# Altium schematic sheet Heating.SchDoc
size 381 x 279 mm; Organization: SACO Technologies; Address1: 7806, Trans-Canada Hwy; Address2: Montreal, QC, Canada - H4S1L3.; Address3: H4S1L3; SheetNumber: 5; SheetTotal: 6; ELE682ProjectName: Conditionning & TLL PCB; ProjectRevision: C; SchDesignedBy1: Alexis Gagnon; SchDesignedBy2: Megane Cyr
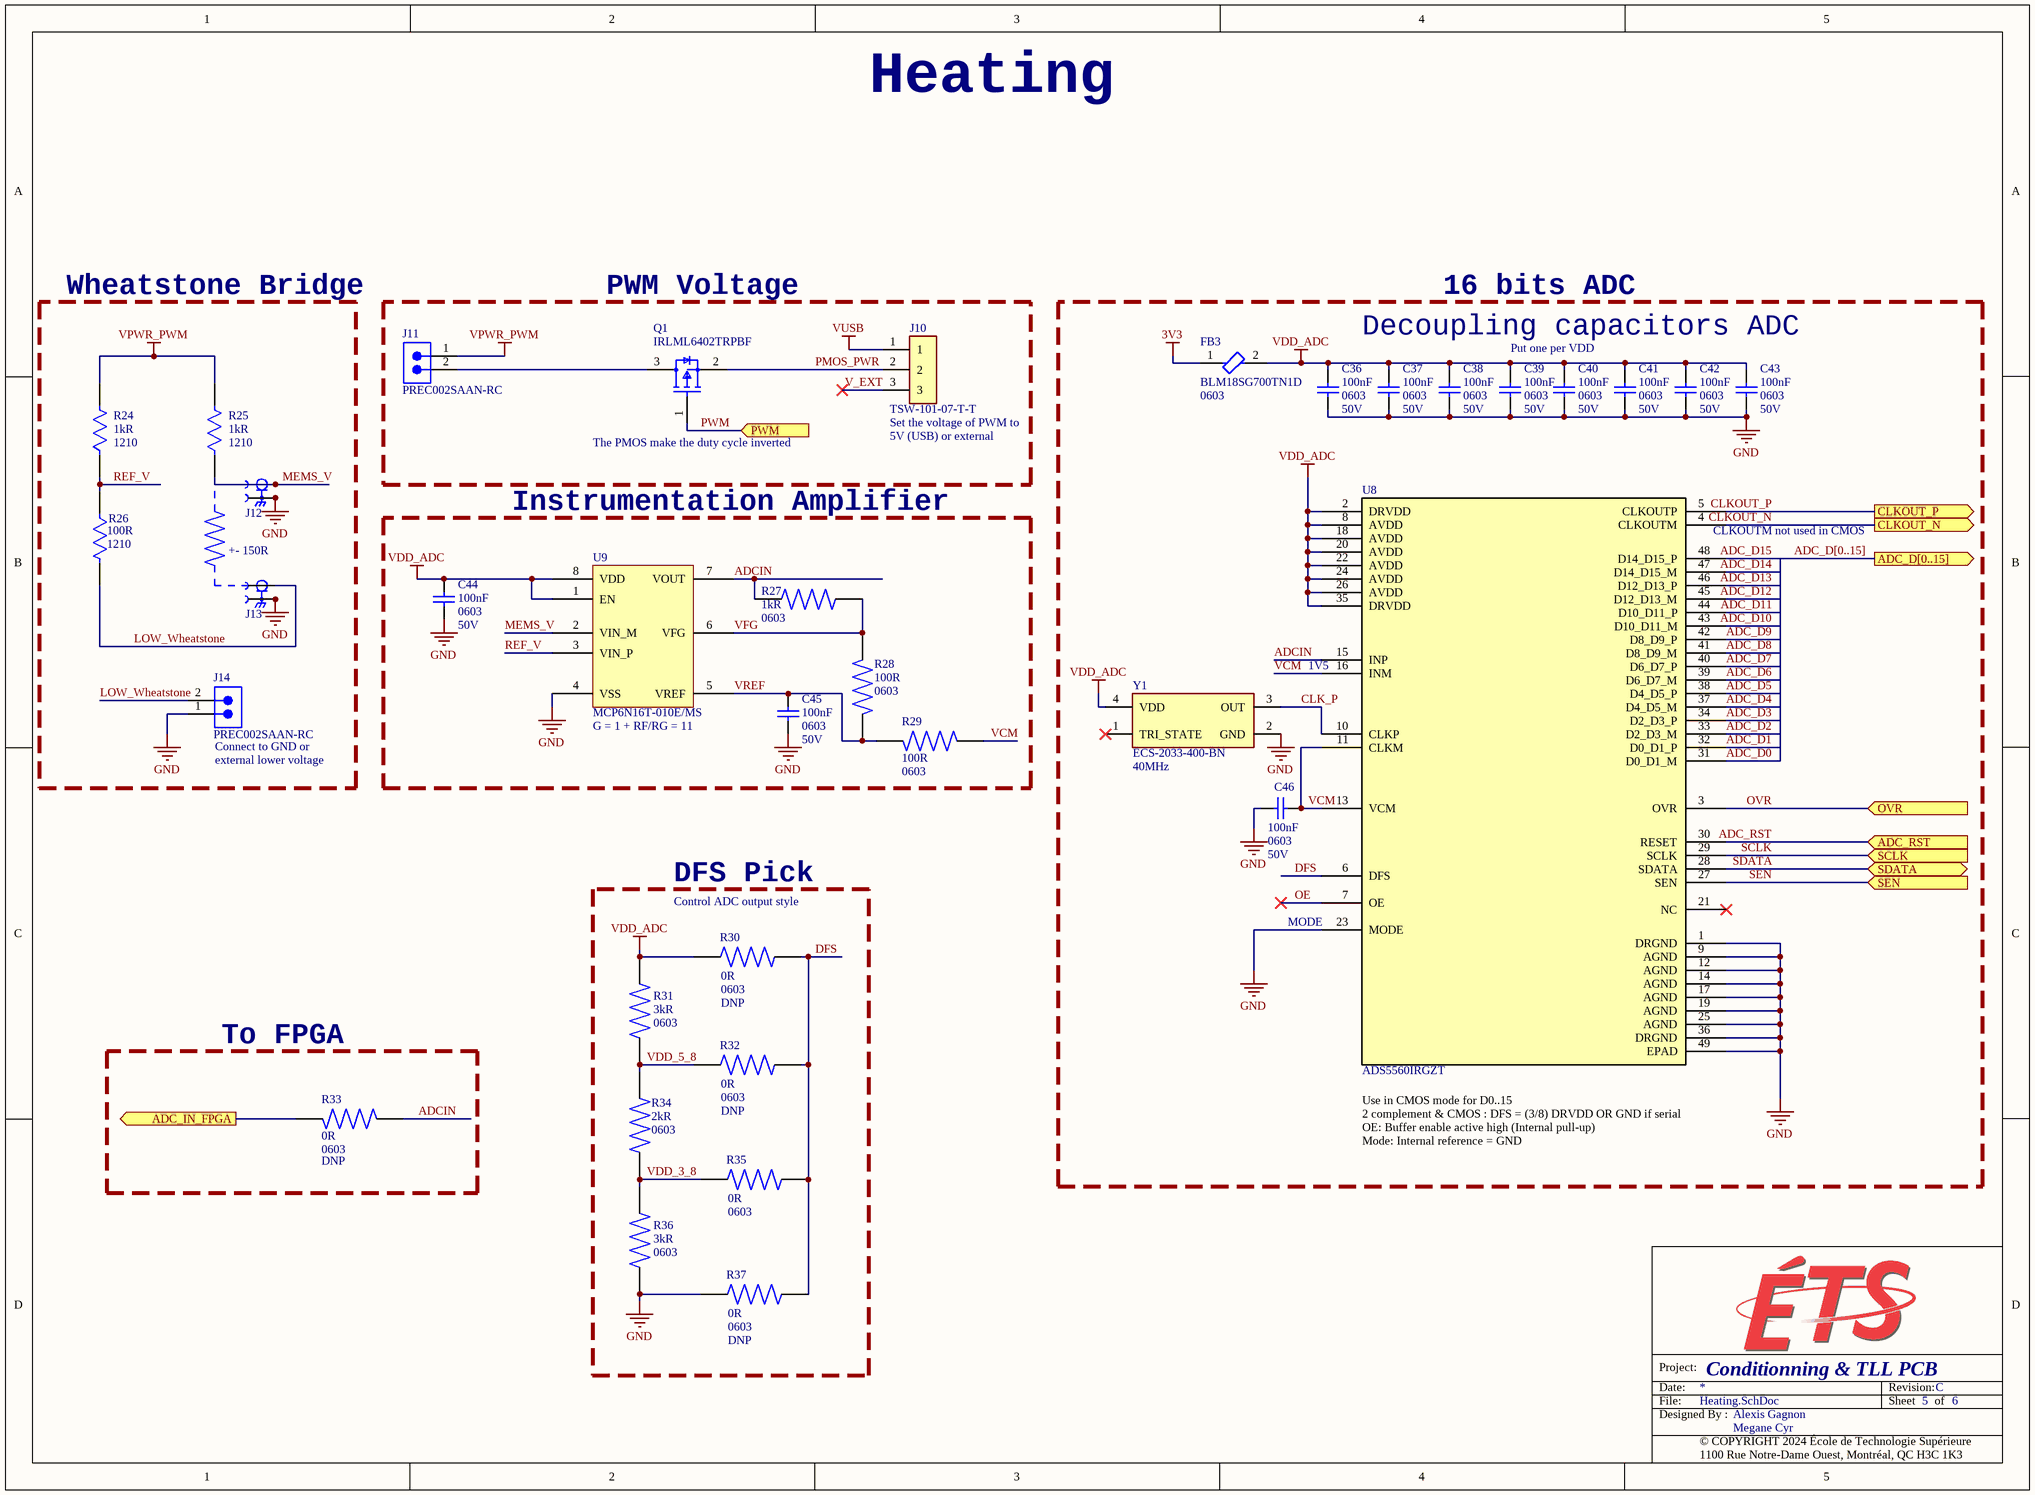
[diagram p0: Heating.SchDoc]

## Parts
C36  value 100nF  Case/Package: 0603  Voltage Rating: 50V  [ANTC1608X90N]  (hidden comment: CL10B104KB8NNWC)
C37  value 100nF  Case/Package: 0603  Voltage Rating: 50V  [ANTC1608X90N]  (hidden comment: CL10B104KB8NNWC)
C38  value 100nF  Case/Package: 0603  Voltage Rating: 50V  [ANTC1608X90N]  (hidden comment: CL10B104KB8NNWC)
C39  value 100nF  Case/Package: 0603  Voltage Rating: 50V  [ANTC1608X90N]  (hidden comment: CL10B104KB8NNWC)
C40  value 100nF  Case/Package: 0603  Voltage Rating: 50V  [ANTC1608X90N]  (hidden comment: CL10B104KB8NNWC)
C41  value 100nF  Case/Package: 0603  Voltage Rating: 50V  [ANTC1608X90N]  (hidden comment: CL10B104KB8NNWC)
C42  value 100nF  Case/Package: 0603  Voltage Rating: 50V  [ANTC1608X90N]  (hidden comment: CL10B104KB8NNWC)
C43  value 100nF  Case/Package: 0603  Voltage Rating: 50V  [ANTC1608X90N]  (hidden comment: CL10B104KB8NNWC)
C44  value 100nF  Case/Package: 0603  Voltage Rating: 50V  [ANTC1608X90N]  (hidden comment: CL10B104KB8NNWC)
C45  value 100nF  Case/Package: 0603  Voltage Rating: 50V  [ANTC1608X90N]  (hidden comment: CL10B104KB8NNWC)
C46  value 100nF  Case/Package: 0603  Voltage Rating: 50V  [ANTC1608X90N]  (hidden comment: CL10B104KB8NNWC)
FB3  BLM18SG700TN1D  Case Code (Imperial): 0603  [BLM18SG700TN1D-MFG]
J10  TSW-101-07-T-T  [SAMTEC_TSW-101-07-T-T]
J11  PREC002SAAN-RC  [CONN_PREC002SAAN-RC_SUL]
J12  CONSMA001-G  [LINX_CONSMA001-G]  (value not drawn)
J13  CONSMA001-G  [LINX_CONSMA001-G]  (value not drawn)
J14  PREC002SAAN-RC  [CONN_PREC002SAAN-RC_SUL]
Q1  IRLML6402TRPBF  [FP-Micro3-MFG]
R24  Case Code (Imperial): 1210  Resistance: 1kR  [FP-ESR25-MFG]  (hidden comment: ESR25JZPJ102)
R25  Case Code (Imperial): 1210  Resistance: 1kR  [FP-ESR25-MFG]  (hidden comment: ESR25JZPJ102)
R26  Case/Package: 1210  Resistance: 100R  [FP-ESR25-MFG]  (hidden comment: ESR25JZPJ101)
R27  value 1kR  Case/Package: 0603  [RC0603N_YAG]  (hidden comment: RC0603FR-071KL)
R28  value 100R  Case/Package: 0603  [RC0603N_YAG]  (hidden comment: RC0605FR-07100RL)
R29  value 100R  Case/Package: 0603  [RC0603N_YAG]  (hidden comment: RC0605FR-07100RL)
R30  value 0R  Case/Package: 0603  [RES_RC0603_YAG]  (hidden comment: RC0603JR-070RL)
R31  value 3kR  Case/Package: 0603  [RC0603N_YAG]  (hidden comment: CRCW06033K00FKEA)
R32  value 0R  Case/Package: 0603  [RES_RC0603_YAG]  (hidden comment: RC0603JR-070RL)
R33  value 0R  Package: 0603  [RESC1508X55N]  (hidden comment: RMCF0603ZT0R00)
R34  value 2kR  Case/Package: 0603  [RC0603N_YAG]  (hidden comment: CRCW06032K00FKEAHP)
R35  value 0R  Case/Package: 0603  [RES_RC0603_YAG]  (hidden comment: RC0603JR-070RL)
R36  value 3kR  Case/Package: 0603  [RC0603N_YAG]  (hidden comment: CRCW06033K00FKEA)
R37  value 0R  Case/Package: 0603  [RES_RC0603_YAG]  (hidden comment: RC0603JR-070RL)
U8  ADS5560IRGZT  [RGZ48_5P15X5P15]
U9  MCP6N16T-010E/MS  [SOP65P490X110-8N]
Y1  ECS-2033-400-BN  value 40MHz  [OSC_ECS-2033-400-BN]

## Blocks framed on the sheet
Wheatstone Bridge: J12-J14 R24-R26
PWM Voltage: J10 J11 Q1
Instrumentation Amplifier: C44 C45 R27-R29 U9
DFS Pick: R30-R32 R34-R37
To FPGA: R33

## Ports
ADC_D[0..15] (out, see TopLevel[3B], Connectors[3A], Power_MCU[1C]), ADC_IN_FPGA (out, see TopLevel[3B], Connectors[3C]), ADC_RST (in, see TopLevel[3B], Power_MCU[1D]), CLKOUT_N (out, see TopLevel[3B], Power_MCU[1C]), CLKOUT_P (out, see TopLevel[3B], Connectors[3B], Power_MCU[1C]), OVR (in, see TopLevel[3B], Power_MCU[1D]), PWM (in, see TopLevel[3B], Connectors[3B], Power_MCU[1D]), SCLK (in, see TopLevel[3B], Power_MCU[1D]), SDATA (bidir, see TopLevel[3B], Power_MCU[1D]), SEN (in, see TopLevel[3B], Power_MCU[1D])

## Nets
3V3: FB3.1
GND: C36.2 C37.2 C38.2 C39.2 C40.2 C41.2 C42.2 C43.2 C44.2 C45.2 C46.2 J12.S1 J12.S2 J12.S3 J12.S4 J13.S1 J13.S2 J13.S3 J13.S4 J14.1 R36.1 R37.1 U8.1(DRGND) U8.9(AGND) U8.12(AGND) U8.14(AGND) U8.17(AGND) U8.19(AGND) U8.23(MODE) U8.25(AGND) U8.36(DRGND) U8.49(EPAD) U9.4(VSS) Y1.2(GND)
VDD_ADC: C36.1 C37.1 C38.1 C39.1 C40.1 C41.1 C42.1 C43.1 C44.1 FB3.2 R30.1 R31.2 U8.2(DRVDD) U8.8(AVDD) U8.18(AVDD) U8.20(AVDD) U8.22(AVDD) U8.24(AVDD) U8.26(AVDD) U8.35(DRVDD) U9.1(EN) U9.8(VDD) Y1.4(VDD)
VPWR_PWM: J11.1 R24.2 R25.2
VUSB: J10.1
ADC_D0: U8.31(D0_D1_M)
ADC_D1: U8.32(D0_D1_P)
ADC_D2: U8.33(D2_D3_M)
ADC_D3: U8.34(D2_D3_P)
ADC_D4: U8.37(D4_D5_M)
ADC_D5: U8.38(D4_D5_P)
ADC_D6: U8.39(D6_D7_M)
ADC_D7: U8.40(D6_D7_P)
ADC_D8: U8.41(D8_D9_M)
ADC_D9: U8.42(D8_D9_P)
ADC_D10: U8.43(D10_D11_M)
ADC_D11: U8.44(D10_D11_P)
ADC_D12: U8.45(D12_D13_M)
ADC_D13: U8.46(D12_D13_P)
ADC_D14: U8.47(D14_D15_M)
ADC_D15: U8.48(D14_D15_P)
ADC_IN_FPGA: R33.2 ; port ADC_IN_FPGA
ADC_RST: U8.30(RESET) ; port ADC_RST
ADCIN: R27.2 R33.1 U8.15(INP) U9.7(VOUT)
CLK_P: U8.10(CLKP) Y1.3(OUT)
CLKOUT_N: U8.4(CLKOUTM) ; port CLKOUT_N
CLKOUT_P: U8.5(CLKOUTP) ; port CLKOUT_P
DFS: R30.2 R32.2 R35.2 R37.2 U8.6(DFS)
LOW_Wheatstone: J13.1 J14.2 R26.2
MEMS_V: J12.1 R25.1 U9.2(VIN_M)
OE: U8.7(OE)
OVR: U8.3(OVR) ; port OVR
PMOS_PWR: J10.2 Q1.2(S)
PWM: Q1.1(G) ; port PWM
REF_V: R24.1 R26.1 U9.3(VIN_P)
SCLK: U8.29(SCLK) ; port SCLK
SDATA: U8.28(SDATA) ; port SDATA
SEN: U8.27(SEN) ; port SEN
V_EXT: J10.3
VCM: C46.1 R29.2 U8.11(CLKM) U8.13(VCM) U8.16(INM)
VDD_3_8: R34.1 R35.1 R36.2
VDD_5_8: R31.1 R32.1 R34.2
VFG: R27.1 R28.1 U9.6(VFG)
VREF: C45.1 R28.2 R29.1 U9.5(VREF)
NetJ11_2: J11.2 Q1.3(D)

Not connected (* = marked no-connect by the designer): U8 21(NC)*; Y1 1(TRI_STATE)*

## Buses and harness runs
bus ADC_D[0..15] = port ADC_D[0..15]

## Notes on the sheet
- Heating
- 16 bits ADC
- Decoupling capacitors ADC
- Put one per VDD
- (near J10) Set the voltage of PWM to
- (near J10) 5V (USB) or external
- (near Q1) The PMOS make the duty cycle inverted
- (near J13) +- 150R
- (near U8) CLKOUTM not used in CMOS
- (near U8) 1V5
- (near J14) Connect to GND or
- (near J14) external lower voltage
- (near U9) G = 1 + RF/RG = 11
- (near R30) Control ADC output style
- (near U8) MODE
- DNP
- (near R33) DNP
- (near U8) Use in CMOS mode for D0..15
  2 complement & CMOS : DFS = (3/8) DRVDD OR GND if serial
  OE: Buffer enable active high (Internal pull-up)
  Mode: Internal reference = GND
- (near R37) DNP
- Project:
- File:
- Date:
- Designed By :
- © COPYRIGHT 2024 École de Technologie Supérieure
- Revision:
- Sheet
- of
- 1100 Rue Notre-Dame Ouest, Montréal, QC H3C 1K3

## Library data of the parts
C36-C46 = CL10B104KB8NNWC: CAP CER 0.1UF 50V X7R 0603; Manufacturer: Samsung; Tolerance: 10%; Supplier: Arrow Electronics; Supplier Part Number: CL10B104KB8NNWC; Manufacturer Part Number: CL10B104KB8NNWC; RoHS: Yes; Category: Ceramic Capacitors; Stock: 4312000; Pricing: 4000=0.0024 (USD); Mounting Technology: Surface Mount; Case Code (Metric): 1608; Case Code (Imperial): 0603; Min Operating Temperature: -55°C; Max Operating Temperature: 125°C; Package Quantity: 1; Packaging: Cut Tape; Series: CL; Length: 0.063inch; Width: 0.031inch; Thickness: 0.035inch; RoHS Compliant: Yes; ComponentLink1URL: https://datasheet.ciiva.com/25740/cl10b104kb8nnwc-25740227.pdf?src-supplier=Digikey; ComponentLink1Description: https://datasheet.ciiva.com/25740/cl10b104kb8nnwc-25740227.pdf?src-supplier=Digikey
FB3 = BLM18SG700TN1D: FERRITE BEAD 70 OHM 0603 1LN; Manufacturer: Murata; Max DC Current: 4A; Tolerance: 25%; DC Resistance (DCR): 20mR; Material: Steel; Test Frequency: 100MHz; Number of Circuits: 1; Impedance: 70R; Filter Type: FERRITE CHIP; Lead Free: Lead Free; Min Operating Temperature: -55°C; Width: 0.8mm; Case Code (Metric): 1608; RoHS Compliant: Yes; Core Material: Ferrite; Max Operating Temperature: 125°C; Number of Pins: 2; Current Rating: 4A; Series: BLM18S; Depth: 0.8mm; Packaging: Tape and Reel; Height: 0.8mm; Number of Lines: 1; Case/Package: 0603; Package Quantity: 1; Termination: SMD/SMT; REACH SVHC: No SVHC; Max Current Rating: 4A; DC Resistance-Max: 20mR; Length: 1.6mm; Supplier: Mouser; Supplier Part Number: 81-BLM18SG700TN1D; Manufacturer Part Number: BLM18SG700TN1D; RoHS: Yes; Category: Ferrite Beads and Chips; Stock: 139676; Pricing: 1=0.14, 10=0.071, 50=0.071, 100=0.049, 1000=0.041, 10000=0.03 (USD); Mounting Technology: Surface Mount; Case Code: 0603; Terminal Finish: Tin; JESD-609 Code: e3; Construction: Chip Bead; Clock Frequency: 100MHz; Min Frequency: 100MHz; Channels: 1; Output Impedance: 70R; Reach SVHC Compliant: Yes; ComponentLink1URL: https://datasheet.ciiva.com:443/pdfs/VipMasterIC/IC/MURE/MURE-S-A0008515766/MURE-S-A0008515869-1.pdf?src-supplier=IHS+Markit; ComponentLink1Description: https://datasheet.ciiva.com:443/pdfs/VipMasterIC/IC/MURE/MURE-S-A0008515766/MURE-S-A0008515869-1.pdf?src-supplier=IHS+Markit; ComponentLink2URL: https://datasheet.ciiva.com/8021/5151-8021529.pdf?src-supplier=Element14; ComponentLink2Description: https://datasheet.ciiva.com/8021/5151-8021529.pdf?src-supplier=Element14; ComponentLink3URL: https://datasheet.ciiva.com/8021/5151-8021530.pdf?src-supplier=Element14; ComponentLink3Description: https://datasheet.ciiva.com/8021/5151-8021530.pdf?src-supplier=Element14; ComponentLink4URL: https://datasheet.ciiva.com/14122/blm-series-eng-tds-14122901.pdf?src-supplier=Distrelec; ComponentLink4Description: https://datasheet.ciiva.com/14122/blm-series-eng-tds-14122901.pdf?src-supplier=Distrelec; ComponentLink5URL: https://datasheet.ciiva.com/6212/l0110s0100blm18s-6212357.pdf?src-supplier=Digikey; ComponentLink5Description: https://datasheet.ciiva.com/6212/l0110s0100blm18s-6212357.pdf?src-supplier=Digikey; ComponentLink6URL: https://datasheet.ciiva.com/6212/l0110s0100blm18s-6212359.pdf?src-supplier=Digikey; ComponentLink6Description: https://datasheet.ciiva.com/6212/l0110s0100blm18s-6212359.pdf?src-supplier=Digikey; ComponentLink7URL: https://datasheet.ciiva.com/16420/l0110s0100blm18s-16420729.pdf?src-supplier=Future+Electronics; ComponentLink7Description: https://datasheet.ciiva.com/16420/l0110s0100blm18s-16420729.pdf?src-supplier=Future+Electronics
J10 = TSW-101-07-T-T: MF: Samtec; Package: None; Value: *; Availability: Unavailable; MP: TSW-101-07-T-T; Price: None
J11 J14 = PREC002SAAN-RC: CONN HEADER .100 SNGL STR 2POS; Manufacturer: Sullins; Number of Positions: 2; Pitch: 0.1inch; Supplier: Digikey; Supplier Part Number: S1012EC-02-ND; Manufacturer Part Number: PREC002SAAN-RC; RoHS: Yes; Category: Connectors; Stock: 28469; Pricing: 1=0.1, 10=0.039, 100=0.0287, 500=0.02378, 1000=0.02081, 5000=0.01784, 10000=0.01734 (USD); Mounting Technology: Through Hole; Color: Black; Contact Plating: Tin; Package Quantity: 1; Number of Rows: 1; Packaging: Bulk; Termination: Solder; Series: -; Contact Type: Male Pin; Contact Mating Length: 0.23inch; RoHS Compliant: Yes; ComponentLink1URL: https://datasheet.ciiva.com/740/zrzczzzszzn-rc-st-11635-b-740843.pdf?src-supplier=Digikey; ComponentLink1Description: https://datasheet.ciiva.com/740/zrzczzzszzn-rc-st-11635-b-740843.pdf?src-supplier=Digikey
J12 J13 = CONSMA001-G: CONN SMA RCPT STR 50 OHM PCB; Value: 50ohm; Package: None; Price: None; MP: CONSMA001-G; Availability: Unavailable
Q1 = IRLML6402TRPBF: MOSFET P-CH 20V 3.7A SOT-23; Manufacturer: Infineon; Reverse Recovery Time: 29ns; Max Forward Diode Voltage: -1.2V; Input Capacitace At Vds: 633pF @ -10V; Drain To Source Resistance: 0.05Ω; Gate To Source Voltage: 12V; Max Junction Temp: +150°C; Pulse Drain Current: -22A; Threshold Vgs Min: -0.4V; Turn Off Delay Time: 588ns; Number Of Channels: 1; Power Dissipation: 1.3W; Turn On Delay Time: 350ns; Drain To Source Breakdown Voltage: -20V; Continuous Drain Current: -3.7A; Depletion Mode: False; Gate Charge At Vgs: 8nC @ -5V; Rthja Max: 75°C/W; Threshold Vgs: -0.55V; Standoff Height: 0.01mm; Reverse Recovery Charge: 11nC; Device Class L2: Transistors; Ipc Land Pattern Name: SOT95P237X100-3; Temperature Range High: +150°C; Octopart: https://octopart.com/irlml6402trpbf-infineon-65874989; ComponentLink2URL: https://www.infineon.com/dgdl/irlml6402pbf.pdf?fileId=5546d462533600a401535668d5c2263c; Automotive: No; Manufacturer Part Number: IRLML6402TRPBF; Height: 1.12mm; Drain To Source Voltage: -20V; Digikey Description: MOSFET P-CH 20V 3.7A SOT-23; Device Class L1: Discrete Semiconductors; Package: Micro3; Lead Free: Yes; Temperature Range Low: -55°C; Number Of P Channels: 1; Technology: MOSFET; Temperature: -55°C to +150°C; Category: Trans; Footprint Url: http://irf.com/package/outline/po_micro3.pdf; RoHS: TRUE; Device Class L3: MOSFETs; Threshold Vgs Max: -1.2V; ComponentLink2Description: Datasheet
R24 R25 = CMP-08839-027853-1: RES 1K OHM 5% 1W 1210; Temperature Coefficient: 200ppm/°C; Max Power Dissipation: 500mW; Package Quantity: 1; Case/Package: 1210; Number of Terminations: 2; Width: 0.098inch; Length: 0.126inch; Packaging: Tape and Reel; Resistor Type: Thick Film; Features: Automotive AEC-Q200; Tolerance: 5%; Min Operating Temperature: -55°C; RoHS Compliant: Yes; Max Operating Temperature: 155°C; Series: ESR; Height: 0.026inch; Case Code (Metric): 3225
R26 = CMP-08839-028974-1: RES 100 OHM 5% 1W 1210; Temperature Coefficient: 200ppm/°C; Max Power Dissipation: 500mW; Series: ESR; Features: Automotive AEC-Q200; Height: 0.026inch; Package Quantity: 1; Case Code (Metric): 3225; Resistor Type: Thick Film; Number of Terminations: 2; Min Operating Temperature: -55°C; Case Code (Imperial): 1210; Width: 0.098inch; Length: 0.126inch; RoHS Compliant: Yes; Tolerance: 5%; Packaging: Tape and Reel; Max Operating Temperature: 155°C
R27 = RC0603FR-071KL: Fixed Resistor, Metal Glaze/thick Film, 0.1W, 1000ohm, 75V, 1% +/-Tol, 100ppm/Cel, Surface Mount, 0603; Manufacturer: Yageo; Additional Feature: LASER TRIMMABLE; Rated Temperature: 70°C; Temperature Coefficient (ppm/Cel): 100; Power: 100mW; Package Height: 0.45mm; Package Length: 1.6mm; Package Width: 0.8mm; Supplier: Avnet; Supplier Part Number: RC0603FR-071KL; Manufacturer Part Number: RC0603FR-071KL; RoHS: Yes; Category: Chip SMD Resistors; Stock: 765000; Pricing: 5000=0.00146, 10000=0.00141, 20000=0.00136, 30000=0.00131, 40000=0.00127 (USD); Mounting Technology: Surface Mount; Pins: 2; Package Shape: Rectangular; Terminal Finish: Nickel; Min Operating Temperature: -55°C; Max Operating Temperature: 155°C; Tolerance: 1%; JESD-609 Code: e3; Technology: METAL GLAZE/THICK FILM; Resistor Type: FIXED RESISTOR; Construction: Chip; Packaging: Tape and Reel; Termination: Wraparound; Working Voltage: 75V; Reach SVHC Compliant: Yes; RoHS Compliant: Yes; ComponentLink1URL: https://datasheet.ciiva.com:443/pdfs/VipMasterIC/IC/YAGO/YAGO-S-A0008145938/YAGO-S-A0008145938-1.pdf?src-supplier=IHS+Markit; ComponentLink1Description: https://datasheet.ciiva.com:443/pdfs/VipMasterIC/IC/YAGO/YAGO-S-A0008145938/YAGO-S-A0008145938-1.pdf?src-supplier=IHS+Markit; ComponentLink2URL: https://datasheet.ciiva.com/11808/0900766b80f96399-11808081.pdf?src-supplier=Rs; ComponentLink2Description: https://datasheet.ciiva.com/11808/0900766b80f96399-11808081.pdf?src-supplier=Rs; ComponentLink3URL: https://datasheet.ciiva.com/7660/1868787-7660790.pdf?src-supplier=Element14; ComponentLink3Description: https://datasheet.ciiva.com/7660/1868787-7660790.pdf?src-supplier=Element14; ComponentLink4URL: https://datasheet.ciiva.com/7746/1738695-7746279.pdf?src-supplier=Element14; ComponentLink4Description: https://datasheet.ciiva.com/7746/1738695-7746279.pdf?src-supplier=Element14; ComponentLink5URL: https://datasheet.ciiva.com/7746/1686128-7746280.pdf?src-supplier=Element14; ComponentLink5Description: https://datasheet.ciiva.com/7746/1686128-7746280.pdf?src-supplier=Element14; ComponentLink6URL: https://datasheet.ciiva.com/7746/1738695-7746281.pdf?src-supplier=Element14; ComponentLink6Description: https://datasheet.ciiva.com/7746/1738695-7746281.pdf?src-supplier=Element14; ComponentLink7URL: https://datasheet.ciiva.com/7983/443971-7983613.pdf?src-supplier=Element14; ComponentLink7Description: https://datasheet.ciiva.com/7983/443971-7983613.pdf?src-supplier=Element14; ComponentLink8URL: https://datasheet.ciiva.com/15189/getdatasheetpartid-404327-15189644.pdf?src-supplier=Verical; ComponentLink8Description: https://datasheet.ciiva.com/15189/getdatasheetpartid-404327-15189644.pdf?src-supplier=Verical; ComponentLink9URL: https://datasheet.ciiva.com/8896/pyu-rc0603-51-rohs-l-4-8896106.pdf?src-supplier=Avnet; ComponentLink9Description: https://datasheet.ciiva.com/8896/pyu-rc0603-51-rohs-l-4-8896106.pdf?src-supplier=Avnet
R28 R29 = RC0605FR-07100RL: Fixed Resistor, Metal Glaze/thick Film, 0.1W, 100ohm, 75V, 1% +/-Tol, 100ppm/Cel, Surface Mount, 0603; Manufacturer: Yageo; Manufacturer Part Number: RC0603FR-07100RL; Power: 100mW; Rated Temperature: 70°C; Temperature Coefficient (ppm/Cel): 100; Additional Feature: LASER TRIMMABLE; Package Height: 0.45mm; Package Length: 1.6mm; Package Width: 0.8mm; Supplier: Avnet; Supplier Part Number: RC0603FR-07100RL; RoHS: Yes; Category: Chip SMD Resistors; Stock: 2650000; Pricing: 5000=0.00146, 10000=0.00141, 20000=0.00136, 30000=0.00131, 40000=0.00127 (USD); Mounting Technology: Surface Mount; Pins: 2; Package Shape: Rectangular; Terminal Finish: Nickel; Min Operating Temperature: -55°C; Max Operating Temperature: 155°C; Tolerance: 1%; Resistor Type: FIXED RESISTOR; Packaging: Tape and Reel; Technology: METAL GLAZE/THICK FILM; Termination: Wraparound; Working Voltage: 75V; JESD-609 Code: e3; Construction: Chip; RoHS Compliant: Yes; Reach SVHC Compliant: Yes; ComponentLink1URL: https://datasheet.ciiva.com:443/pdfs/VipMasterIC/IC/YAGO/YAGO-S-A0008145938/YAGO-S-A0008145938-1.pdf?src-supplier=IHS+Markit; ComponentLink1Description: https://datasheet.ciiva.com:443/pdfs/VipMasterIC/IC/YAGO/YAGO-S-A0008145938/YAGO-S-A0008145938-1.pdf?src-supplier=IHS+Markit
R30 R32 R35 R37 = RC0603JR-070RL: Metal Glaze/thick Film, 0.1W, 0ohm, Surface Mount, 0603; Manufacturer: Yageo; Power: 100mW; Rated Temperature: 70°C; Package Height: 0.45mm; Package Length: 1.6mm; Package Width: 0.8mm; Supplier: Future Electronics; Supplier Part Number: 3992146; Manufacturer Part Number: RC0603JR-070RL; RoHS: Yes; Category: Chip SMD Resistors; Stock: 21660000; Pricing: 5000=0.0015, 50000=0.0014, 150000=0.0014, 375000=0.0013, 1000000=0.0012 (USD); Mounting Technology: Surface Mount; Pins: 2; Package Shape: Rectangular; Terminal Finish: Nickel; Min Operating Temperature: -55°C; Max Operating Temperature: 155°C; JESD-609 Code: e3; Resistor Type: FIXED RESISTOR; Construction: Chip; Package Style: SMTMeter; Packaging: Tape and Reel; Technology: METAL GLAZE/THICK FILM; Termination: Wraparound; Reach SVHC Compliant: Yes; RoHS Compliant: Yes; ComponentLink1URL: https://datasheet.ciiva.com:443/pdfs/VipMasterIC/IC/YAGO/YAGO-S-A0008145938/YAGO-S-A0008145938-1.pdf?src-supplier=IHS+Markit; ComponentLink1Description: https://datasheet.ciiva.com:443/pdfs/VipMasterIC/IC/YAGO/YAGO-S-A0008145938/YAGO-S-A0008145938-1.pdf?src-supplier=IHS+Markit; ComponentLink2URL: https://datasheet.ciiva.com/11808/pyu-r-int-6-11808700.pdf?src-supplier=Rs; ComponentLink2Description: https://datasheet.ciiva.com/11808/pyu-r-int-6-11808700.pdf?src-supplier=Rs; ComponentLink3URL: https://datasheet.ciiva.com/22747/443971-22747530.pdf?src-supplier=Element14; ComponentLink3Description: https://datasheet.ciiva.com/22747/443971-22747530.pdf?src-supplier=Element14; ComponentLink4URL: https://datasheet.ciiva.com/12555/rc0603-272842-12555254.pdf?src-supplier=Mouser; ComponentLink4Description: https://datasheet.ciiva.com/12555/rc0603-272842-12555254.pdf?src-supplier=Mouser; ComponentLink5URL: https://datasheet.ciiva.com/7746/1738695-7746421.pdf?src-supplier=Element14; ComponentLink5Description: https://datasheet.ciiva.com/7746/1738695-7746421.pdf?src-supplier=Element14; ComponentLink6URL: https://datasheet.ciiva.com/7746/1738695-7746422.pdf?src-supplier=Element14; ComponentLink6Description: https://datasheet.ciiva.com/7746/1738695-7746422.pdf?src-supplier=Element14; ComponentLink7URL: https://datasheet.ciiva.com/8883/pyu-rc0603-51-rohs-l-4-8883045.pdf?src-supplier=Avnet; ComponentLink7Description: https://datasheet.ciiva.com/8883/pyu-rc0603-51-rohs-l-4-8883045.pdf?src-supplier=Avnet; ComponentLink8URL: https://datasheet.ciiva.com/15189/getdatasheetpartid-329462-15189845.pdf?src-supplier=Verical; ComponentLink8Description: https://datasheet.ciiva.com/15189/getdatasheetpartid-329462-15189845.pdf?src-supplier=Verical
R31 R36 = CRCW06033K00FKEA: RES SMD 3K OHM 1% 1/10W 0603; Manufacturer: Vishay; Power: 100mW; Rated Temperature: 70°C; Working Voltage: 75V; Temperature Coefficient (ppm/Cel): 100; Package Height: 0.45mm; Package Length: 1.55mm; Package Width: 0.85mm; Reference Standard: AEC-Q200; Supplier: Avnet; Supplier Part Number: CRCW06033K00FKEA; Manufacturer Part Number: CRCW06033K00FKEA; RoHS: Yes; Category: Chip SMD Resistors; Stock: 1745000; Pricing: 5000=0.00112 (USD); Mounting Technology: Surface Mount; Pins: 2; Terminal Finish: Nickel; Package Shape: Rectangular; Min Operating Temperature: -55°C; Max Operating Temperature: 155°C; Tolerance: 1%; JESD-609 Code: e3; Resistor Type: FIXED RESISTOR; Construction: Chip; Packaging: Tape and Reel; Technology: METAL GLAZE/THICK FILM; Termination: Wraparound; Reach SVHC Compliant: Yes; RoHS Compliant: Yes; ComponentLink1URL: https://datasheet.ciiva.com:443/pdfs/VipMasterIC/IC/VISH/VISH-S-A0007266705/VISH-S-A0007266705-1.pdf?src-supplier=IHS+Markit; ComponentLink1Description: https://datasheet.ciiva.com:443/pdfs/VipMasterIC/IC/VISH/VISH-S-A0007266705/VISH-S-A0007266705-1.pdf?src-supplier=IHS+Markit; ComponentLink2URL: https://datasheet.ciiva.com/11809/0900766b80d98afc-11809944.pdf?src-supplier=Rs; ComponentLink2Description: https://datasheet.ciiva.com/11809/0900766b80d98afc-11809944.pdf?src-supplier=Rs; ComponentLink3URL: https://datasheet.ciiva.com/2466/dcrcwe3-2466029.pdf?src-supplier=Digikey; ComponentLink3Description: https://datasheet.ciiva.com/2466/dcrcwe3-2466029.pdf?src-supplier=Digikey; ComponentLink4URL: https://datasheet.ciiva.com/2466/dcrcwe3-2466030.pdf?src-supplier=Digikey; ComponentLink4Description: https://datasheet.ciiva.com/2466/dcrcwe3-2466030.pdf?src-supplier=Digikey; ComponentLink5URL: https://datasheet.ciiva.com/2466/dcrcwe3-2466031.pdf?src-supplier=Digikey; ComponentLink5Description: https://datasheet.ciiva.com/2466/dcrcwe3-2466031.pdf?src-supplier=Digikey; ComponentLink6URL: https://datasheet.ciiva.com/3257/dcrcwe3-3257528.pdf?src-supplier=Avnet; ComponentLink6Description: https://datasheet.ciiva.com/3257/dcrcwe3-3257528.pdf?src-supplier=Avnet; ComponentLink7URL: https://datasheet.ciiva.com/3257/dcrcwe3-3257529.pdf?src-supplier=Avnet; ComponentLink7Description: https://datasheet.ciiva.com/3257/dcrcwe3-3257529.pdf?src-supplier=Avnet; ComponentLink8URL: https://datasheet.ciiva.com/5545/dcrcwe3-109170-5545849.pdf?src-supplier=Mouser; ComponentLink8Description: https://datasheet.ciiva.com/5545/dcrcwe3-109170-5545849.pdf?src-supplier=Mouser; ComponentLink9URL: https://datasheet.ciiva.com/16767/70201119-16767917.pdf?src-supplier=Allied+Electronics; ComponentLink9Description: https://datasheet.ciiva.com/16767/70201119-16767917.pdf?src-supplier=Allied+Electronics; ComponentLink10URL: https://datasheet.ciiva.com/16778/70201119-16778734.pdf?src-supplier=Allied+Electronics; ComponentLink10Description: https://datasheet.ciiva.com/16778/70201119-16778734.pdf?src-supplier=Allied+Electronics; ComponentLink11URL: https://datasheet.ciiva.com/7690/1697337-7690717.pdf?src-supplier=Element14; ComponentLink11Description: https://datasheet.ciiva.com/7690/1697337-7690717.pdf?src-supplier=Element14; ComponentLink12URL: https://datasheet.ciiva.com/7690/1720486-7690863.pdf?src-supplier=Element14; ComponentLink12Description: https://datasheet.ciiva.com/7690/1720486-7690863.pdf?src-supplier=Element14
R33 = RMCF0603ZT0R00: 0 Ohms Jumper 0.1W, 1/10W Chip Resistor 0603 (1608 Metric) Automotive AEC-Q200 Thick Film; MF: Stackpole Electronics; SnapEDA_Link: https://www.snapeda.com/parts/RMCF0603ZT0R00/Stackpole+Electronics+Inc/view-part/?ref=snap; MP: RMCF0603ZT0R00; Check_prices: https://www.snapeda.com/parts/RMCF0603ZT0R00/Stackpole+Electronics+Inc/view-part/?ref=eda
R34 = CRCW06032K00FKEAHP: RES SMD 2K OHM 1% 1/3W 0603; Manufacturer: Vishay; Power: 100mW; Rated Temperature: 70°C; Working Voltage: 75V; Temperature Coefficient (ppm/Cel): 100; Package Height: 0.45mm; Package Length: 1.55mm; Package Width: 0.85mm; Reference Standard: AEC-Q200; Supplier: Avnet; Supplier Part Number: CRCW06032K00FKEA; Manufacturer Part Number: CRCW06032K00FKEA; RoHS: Yes; Category: Chip SMD Resistors; Stock: 2445000; Pricing: 5000=0.00112 (USD); Mounting Technology: Surface Mount; Pins: 2; Terminal Finish: Nickel; Package Shape: Rectangular; Min Operating Temperature: -55°C; Max Operating Temperature: 155°C; Tolerance: 1%; JESD-609 Code: e3; Resistor Type: FIXED RESISTOR; Construction: Chip; Packaging: Tape and Reel; Technology: METAL GLAZE/THICK FILM; Termination: Wraparound; Reach SVHC Compliant: Yes; RoHS Compliant: Yes; ComponentLink1URL: https://datasheet.ciiva.com:443/pdfs/VipMasterIC/IC/VISH/VISH-S-A0007266705/VISH-S-A0007266705-1.pdf?src-supplier=IHS+Markit; ComponentLink1Description: https://datasheet.ciiva.com:443/pdfs/VipMasterIC/IC/VISH/VISH-S-A0007266705/VISH-S-A0007266705-1.pdf?src-supplier=IHS+Markit; ComponentLink2URL: https://datasheet.ciiva.com/2465/dcrcwe3-2465564.pdf?src-supplier=Digikey; ComponentLink2Description: https://datasheet.ciiva.com/2465/dcrcwe3-2465564.pdf?src-supplier=Digikey; ComponentLink3URL: https://datasheet.ciiva.com/2465/dcrcwe3-2465565.pdf?src-supplier=Digikey; ComponentLink3Description: https://datasheet.ciiva.com/2465/dcrcwe3-2465565.pdf?src-supplier=Digikey; ComponentLink4URL: https://datasheet.ciiva.com/2465/dcrcwe3-2465566.pdf?src-supplier=Digikey; ComponentLink4Description: https://datasheet.ciiva.com/2465/dcrcwe3-2465566.pdf?src-supplier=Digikey; ComponentLink5URL: https://datasheet.ciiva.com/16755/70201119-16755770.pdf?src-supplier=Allied+Electronics; ComponentLink5Description: https://datasheet.ciiva.com/16755/70201119-16755770.pdf?src-supplier=Allied+Electronics; ComponentLink6URL: https://datasheet.ciiva.com/16765/70201119-16765388.pdf?src-supplier=Allied+Electronics; ComponentLink6Description: https://datasheet.ciiva.com/16765/70201119-16765388.pdf?src-supplier=Allied+Electronics; ComponentLink7URL: https://datasheet.ciiva.com/7673/1720486-7673525.pdf?src-supplier=Element14; ComponentLink7Description: https://datasheet.ciiva.com/7673/1720486-7673525.pdf?src-supplier=Element14; ComponentLink8URL: https://datasheet.ciiva.com/28621/125364-28621397.pdf?src-supplier=Element14; ComponentLink8Description: https://datasheet.ciiva.com/28621/125364-28621397.pdf?src-supplier=Element14; ComponentLink9URL: https://datasheet.ciiva.com/3257/dcrcwe3-3257366.pdf?src-supplier=Avnet; ComponentLink9Description: https://datasheet.ciiva.com/3257/dcrcwe3-3257366.pdf?src-supplier=Avnet; ComponentLink10URL: https://datasheet.ciiva.com/3257/dcrcwe3-3257367.pdf?src-supplier=Avnet; ComponentLink10Description: https://datasheet.ciiva.com/3257/dcrcwe3-3257367.pdf?src-supplier=Avnet; ComponentLink11URL: https://datasheet.ciiva.com/26314/fld-crcw-e3-data-en-26314682.pdf?src-supplier=Distrelec; ComponentLink11Description: https://datasheet.ciiva.com/26314/fld-crcw-e3-data-en-26314682.pdf?src-supplier=Distrelec; ComponentLink12URL: https://datasheet.ciiva.com/5551/dcrcwe3-109170-5551994.pdf?src-supplier=Mouser; ComponentLink12Description: https://datasheet.ciiva.com/5551/dcrcwe3-109170-5551994.pdf?src-supplier=Mouser
U8 = ADS5560IRGZT: 16-Bit, 40-MSPS Analog-to-Digital Converter (ADC) 48-VQFN -40 to 85; Manufacturer_Name: Texas Instruments; Copyright: Copyright (C) 2025 Ultra Librarian. All rights reserved.; Manufacturer_Part_Number: ADS5560IRGZT; Datasheet: https://www.ti.com/lit/gpn/ads5560; RefDes: RefDes; Type: Type
U9 = MCP6N16T-010E/MS: IC INST AMP 1 CIRCUIT 8MSOP; Manufacturer: Microchip; Amplifier Type: INSTRUMENTATION AMPLIFIER; Time @ Peak Reflow Temperature-Max (s): 40s; Supplier: Newark; Supplier Part Number: 44AC2577; Manufacturer Part Number: MCP6N16T-010E/MS; RoHS: Yes; Category: Amplifiers - Op Amps, Buffer, Instrumentation; Stock: 1362; Pricing: 1=2.64, 10=2.54, 25=2.16 (USD); Terminal Finish: Tin; JESD-609 Code: e3; Moisture Sensitivity Level: 1; Peak Reflow Temperature (Cel): 260°C; Reach SVHC Compliant: Yes; RoHS Compliant: Yes; ComponentLink1URL: https://datasheet.ciiva.com:443/pdfs/VipMasterIC/IC/MCHP/MCHPS05684/MCHPS05684-1.pdf?src-supplier=IHS+Markit; ComponentLink1Description: https://datasheet.ciiva.com:443/pdfs/VipMasterIC/IC/MCHP/MCHPS05684/MCHPS05684-1.pdf?src-supplier=IHS+Markit; ComponentLink2URL: http://www.mouser.com/ds/2/268/20005318A-355773.pdf?src-supplier=Mouser; ComponentLink2Description: http://www.mouser.com/ds/2/268/20005318A-355773.pdf?src-supplier=Mouser; ComponentLink3URL: http://ww1.microchip.com/downloads/en/DeviceDoc/20005318A.pdf?src-supplier=Avnet; ComponentLink3Description: http://ww1.microchip.com/downloads/en/DeviceDoc/20005318A.pdf?src-supplier=Avnet; ComponentLink4URL: http://www.microchip.com/mymicrochip/filehandler.aspx?ddocname=en571166&src-supplier=Digikey; ComponentLink4Description: http://www.microchip.com/mymicrochip/filehandler.aspx?ddocname=en571166&src-supplier=Digikey; ComponentLink5URL: https://datasheet.octopart.com/MCP6N16T-010E-MS-Microchip-datasheet-27889795.pdf?src-supplier=microchipDIRECT; ComponentLink5Description: https://datasheet.octopart.com/MCP6N16T-010E-MS-Microchip-datasheet-27889795.pdf?src-supplier=microchipDIRECT; ComponentLink6URL: https://datasheet.octopart.com/MCP6N16T-010E-MS-Microchip-datasheet-27889795.pdf?src-supplier=Electro+Sonic; ComponentLink6Description: https://datasheet.octopart.com/MCP6N16T-010E-MS-Microchip-datasheet-27889795.pdf?src-supplier=Electro+Sonic; ComponentLink7URL: https://datasheet.octopart.com/MCP6N16T-010E-MS-Microchip-datasheet-27889795.pdf?src-supplier=Master+Electronics; ComponentLink7Description: https://datasheet.octopart.com/MCP6N16T-010E-MS-Microchip-datasheet-27889795.pdf?src-supplier=Master+Electronics
Y1 = ECS-2033-400-BN: subminiature SMD oscillators; Package: None; Price: None; MP: ECS-2033-400-BN; Availability: Unavailable